# Altium schematic sheet S7CAS-PLEIADES-CARTE-MERE_P01_FPGA-BANK3.SchDoc
size Tabloid; DocumentNumber: 14; SheetNumber: 14; SheetTotal: 17; Sheet_Name: FPGA - BANK 3; Size: 11x17
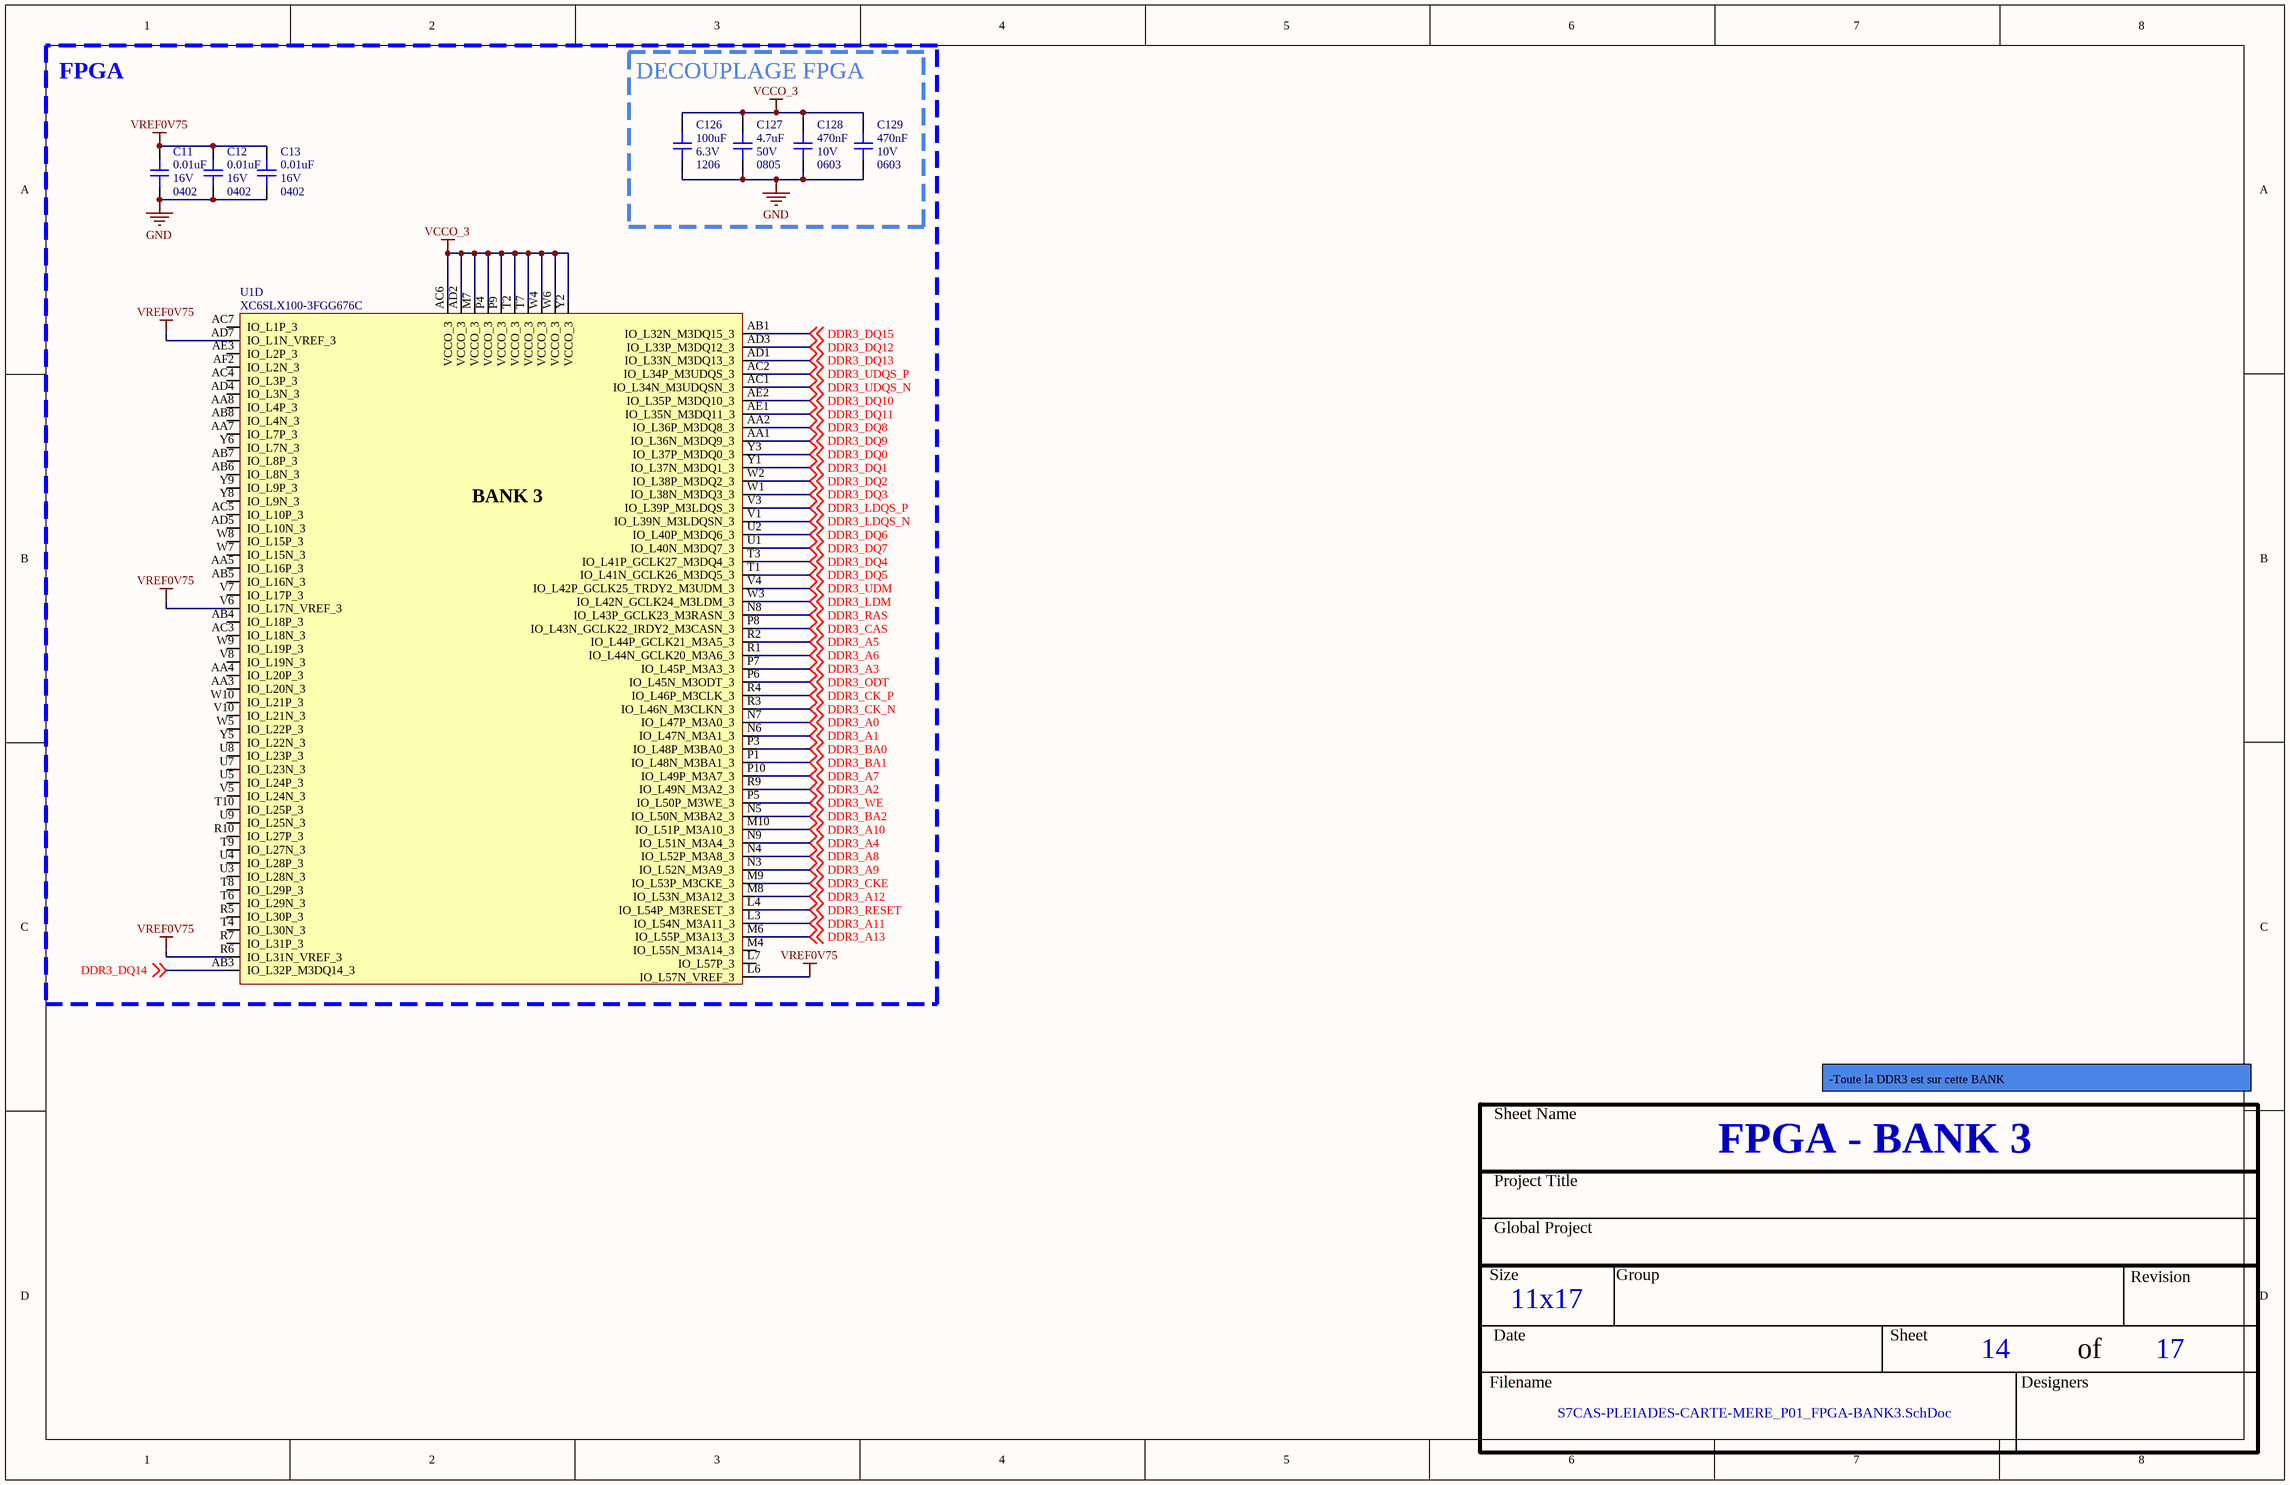
[diagram p0: S7CAS-PLEIADES-CARTE-MERE_P01_FPGA-BANK3.SchDoc]

## Parts
C11  value 0.01uF  Voltage: 16V  Package: 0402  [CAP_0402]  (hidden comment: CAP - 0402)
C12  value 0.01uF  Voltage: 16V  Package: 0402  [CAP_0402]  (hidden comment: CAP - 0402)
C13  value 0.01uF  Voltage: 16V  Package: 0402  [CAP_0402]  (hidden comment: CAP - 0402)
C126  value 100uF  Voltage: 6.3V  Package: 1206  [CAP_1206]  (hidden comment: CAP - 1206)
C127  value 4.7uF  Voltage: 50V  Package: 0805  [CAP_0805]  (hidden comment: CAP - 0805)
C128  value 470nF  Voltage: 10V  Package: 0603  [CAP_0603]  (hidden comment: CAP - 0603)
C129  value 470nF  Voltage: 10V  Package: 0603  [CAP_0603]  (hidden comment: CAP - 0603)
U1  XC6SLX100-3FGG676C  [FPGA_XILINX_FGG676]  (part D of 10)

## Blocks framed on the sheet
FPGA: C11-C13 U1
DECOUPLAGE FPGA: C126-C129

## Nets
GND: C11.1 C12.1 C13.1 C126.1 C127.1 C128.1 C129.1
VCCO_3: C126.2 C127.2 C128.2 C129.2 U1.AC6(VCCO_3) U1.AD2(VCCO_3) U1.M7(VCCO_3) U1.P4(VCCO_3) U1.P9(VCCO_3) U1.T2(VCCO_3) U1.T7(VCCO_3) U1.W4(VCCO_3) U1.W6(VCCO_3) U1.Y2(VCCO_3)
VREF0V75: C11.2 C12.2 C13.2 U1.AD7(IO_L1N_VREF_3) U1.L6(IO_L57N_VREF_3) U1.R6(IO_L31N_VREF_3) U1.V6(IO_L17N_VREF_3)
DDR3_A0: U1.N7(IO_L47P_M3A0_3) ; off-sheet DDR3_A0
DDR3_A1: U1.N6(IO_L47N_M3A1_3) ; off-sheet DDR3_A1
DDR3_A2: U1.R9(IO_L49N_M3A2_3) ; off-sheet DDR3_A2
DDR3_A3: U1.P7(IO_L45P_M3A3_3) ; off-sheet DDR3_A3
DDR3_A4: U1.N9(IO_L51N_M3A4_3) ; off-sheet DDR3_A4
DDR3_A5: U1.R2(IO_L44P_GCLK21_M3A5_3) ; off-sheet DDR3_A5
DDR3_A6: U1.R1(IO_L44N_GCLK20_M3A6_3) ; off-sheet DDR3_A6
DDR3_A7: U1.P10(IO_L49P_M3A7_3) ; off-sheet DDR3_A7
DDR3_A8: U1.N4(IO_L52P_M3A8_3) ; off-sheet DDR3_A8
DDR3_A9: U1.N3(IO_L52N_M3A9_3) ; off-sheet DDR3_A9
DDR3_A10: U1.M10(IO_L51P_M3A10_3) ; off-sheet DDR3_A10
DDR3_A11: U1.L3(IO_L54N_M3A11_3) ; off-sheet DDR3_A11
DDR3_A12: U1.M8(IO_L53N_M3A12_3) ; off-sheet DDR3_A12
DDR3_A13: U1.M6(IO_L55P_M3A13_3) ; off-sheet DDR3_A13
DDR3_BA0: U1.P3(IO_L48P_M3BA0_3) ; off-sheet DDR3_BA0
DDR3_BA1: U1.P1(IO_L48N_M3BA1_3) ; off-sheet DDR3_BA1
DDR3_BA2: U1.N5(IO_L50N_M3BA2_3) ; off-sheet DDR3_BA2
DDR3_CAS: U1.P8(IO_L43N_GCLK22_IRDY2_M3CASN_3) ; off-sheet DDR3_CAS
DDR3_CK_N: U1.R3(IO_L46N_M3CLKN_3) ; off-sheet DDR3_CK_N
DDR3_CK_P: U1.R4(IO_L46P_M3CLK_3) ; off-sheet DDR3_CK_P
DDR3_CKE: U1.M9(IO_L53P_M3CKE_3) ; off-sheet DDR3_CKE
DDR3_DQ0: U1.Y3(IO_L37P_M3DQ0_3) ; off-sheet DDR3_DQ0
DDR3_DQ1: U1.Y1(IO_L37N_M3DQ1_3) ; off-sheet DDR3_DQ1
DDR3_DQ2: U1.W2(IO_L38P_M3DQ2_3) ; off-sheet DDR3_DQ2
DDR3_DQ3: U1.W1(IO_L38N_M3DQ3_3) ; off-sheet DDR3_DQ3
DDR3_DQ4: U1.T3(IO_L41P_GCLK27_M3DQ4_3) ; off-sheet DDR3_DQ4
DDR3_DQ5: U1.T1(IO_L41N_GCLK26_M3DQ5_3) ; off-sheet DDR3_DQ5
DDR3_DQ6: U1.U2(IO_L40P_M3DQ6_3) ; off-sheet DDR3_DQ6
DDR3_DQ7: U1.U1(IO_L40N_M3DQ7_3) ; off-sheet DDR3_DQ7
DDR3_DQ8: U1.AA2(IO_L36P_M3DQ8_3) ; off-sheet DDR3_DQ8
DDR3_DQ9: U1.AA1(IO_L36N_M3DQ9_3) ; off-sheet DDR3_DQ9
DDR3_DQ10: U1.AE2(IO_L35P_M3DQ10_3) ; off-sheet DDR3_DQ10
DDR3_DQ11: U1.AE1(IO_L35N_M3DQ11_3) ; off-sheet DDR3_DQ11
DDR3_DQ12: U1.AD3(IO_L33P_M3DQ12_3) ; off-sheet DDR3_DQ12
DDR3_DQ13: U1.AD1(IO_L33N_M3DQ13_3) ; off-sheet DDR3_DQ13
DDR3_DQ14: U1.AB3(IO_L32P_M3DQ14_3) ; off-sheet DDR3_DQ14
DDR3_DQ15: U1.AB1(IO_L32N_M3DQ15_3) ; off-sheet DDR3_DQ15
DDR3_LDM: U1.W3(IO_L42N_GCLK24_M3LDM_3) ; off-sheet DDR3_LDM
DDR3_LDQS_N: U1.V1(IO_L39N_M3LDQSN_3) ; off-sheet DDR3_LDQS_N
DDR3_LDQS_P: U1.V3(IO_L39P_M3LDQS_3) ; off-sheet DDR3_LDQS_P
DDR3_ODT: U1.P6(IO_L45N_M3ODT_3) ; off-sheet DDR3_ODT
DDR3_RAS: U1.N8(IO_L43P_GCLK23_M3RASN_3) ; off-sheet DDR3_RAS
DDR3_RESET: U1.L4(IO_L54P_M3RESET_3) ; off-sheet DDR3_RESET
DDR3_UDM: U1.V4(IO_L42P_GCLK25_TRDY2_M3UDM_3) ; off-sheet DDR3_UDM
DDR3_UDQS_N: U1.AC1(IO_L34N_M3UDQSN_3) ; off-sheet DDR3_UDQS_N
DDR3_UDQS_P: U1.AC2(IO_L34P_M3UDQS_3) ; off-sheet DDR3_UDQS_P
DDR3_WE: U1.P5(IO_L50P_M3WE_3) ; off-sheet DDR3_WE

Not connected (* = marked no-connect by the designer): U1 AA3(IO_L20N_3) AA4(IO_L20P_3) AA5(IO_L16P_3) AA7(IO_L7P_3) AA8(IO_L4P_3) AB4(IO_L18P_3) AB5(IO_L16N_3) AB6(IO_L8N_3) AB7(IO_L8P_3) AB8(IO_L4N_3) AC3(IO_L18N_3) AC4(IO_L3P_3) AC5(IO_L10P_3) AC7(IO_L1P_3) AD4(IO_L3N_3) AD5(IO_L10N_3) AE3(IO_L2P_3) AF2(IO_L2N_3) L7(IO_L57P_3) M4(IO_L55N_M3A14_3) R5(IO_L30P_3) R7(IO_L31P_3) R10(IO_L27P_3) T4(IO_L30N_3) T6(IO_L29N_3) T8(IO_L29P_3) T9(IO_L27N_3) T10(IO_L25P_3) U3(IO_L28N_3) U4(IO_L28P_3) U5(IO_L24P_3) U7(IO_L23N_3) U8(IO_L23P_3) U9(IO_L25N_3) V5(IO_L24N_3) V7(IO_L17P_3) V8(IO_L19N_3) V10(IO_L21N_3) W5(IO_L22P_3) W7(IO_L15N_3) W8(IO_L15P_3) W9(IO_L19P_3) W10(IO_L21P_3) Y5(IO_L22N_3) Y6(IO_L7N_3) Y8(IO_L9N_3) Y9(IO_L9P_3)

## Notes on the sheet
- -Toute la DDR3 est sur cette BANK
- Sheet Name
- Project Title
- Global Project
- Size
- Group
- Revision
- Date
- Sheet
- of
- Filename
- Designers
- (in symbol FPGA_XC6SLX100-3FGG676C, part D) BANK 3

## Library data of the parts
C11-C13 = CAP - 0402: 10000 pF ±10% 16V Ceramic Capacitor X7R 0402 (1005 Metric); Part Number #1: C0402C103K4RACTU; Mfg: KEMET; Current: *; CreatedBy: Jonathan Bouchard; Power: *; Precision: 10%; Mfg Part Number: C0402C103K4RACTU
C126 = CAP - 1206: 100 µF ±20% 6.3V Ceramic Capacitor X6T 1206 (3216 Metric); Mfg Part Number: GRM31CD80J107MEA8K; Mfg: Murata Electronics; Current: *; CreatedBy: Jonathan Bouchard; Power: *; Precision: 20%
C127 = CAP - 0805: 4.7 µF ±10% 50V Ceramic Capacitor X5R 0805 (2012 Metric); Mfg Part Number: GRT21BR61H475KE13L; Mfg: Murata Electronics; Current: *; CreatedBy: Jonathan Bouchard; Power: *; Precision: 10%
C128 C129 = CAP - 0603: Mfg Part Number: C0603X474K8RAC; Precision: 10%; Current: *; CreatedBy: Jonathan Bouchard; Power: *
U1 = FPGA_XC6SLX100-3FGG676C: FPGA - XILINX SPARTAN 6 480 I/O - BGA-676; Voltage: 1.14 V ~ 1.26 V; Current: *; Power: *; Mfg: Xilinx; Mfg Part Number: XC6SLX100-3FGG676C; HelpURL: https://www.xilinx.com/support/documentation/data_sheets/ds162.pdf; CreatedBy: Jonathan Bouchard; Temperature: 0°C ~ 85°C (TJ); Value: *; Precision: *; Package: BGA-676; Supplier 1: Digikey; Supplier Part Number 1: 122-1760-ND; Part Number #1: XC6SLX100-3FGG676C